# EAGLE design OSSII2CTest (EAGLE 6.1)

## Sheet 1 of 3
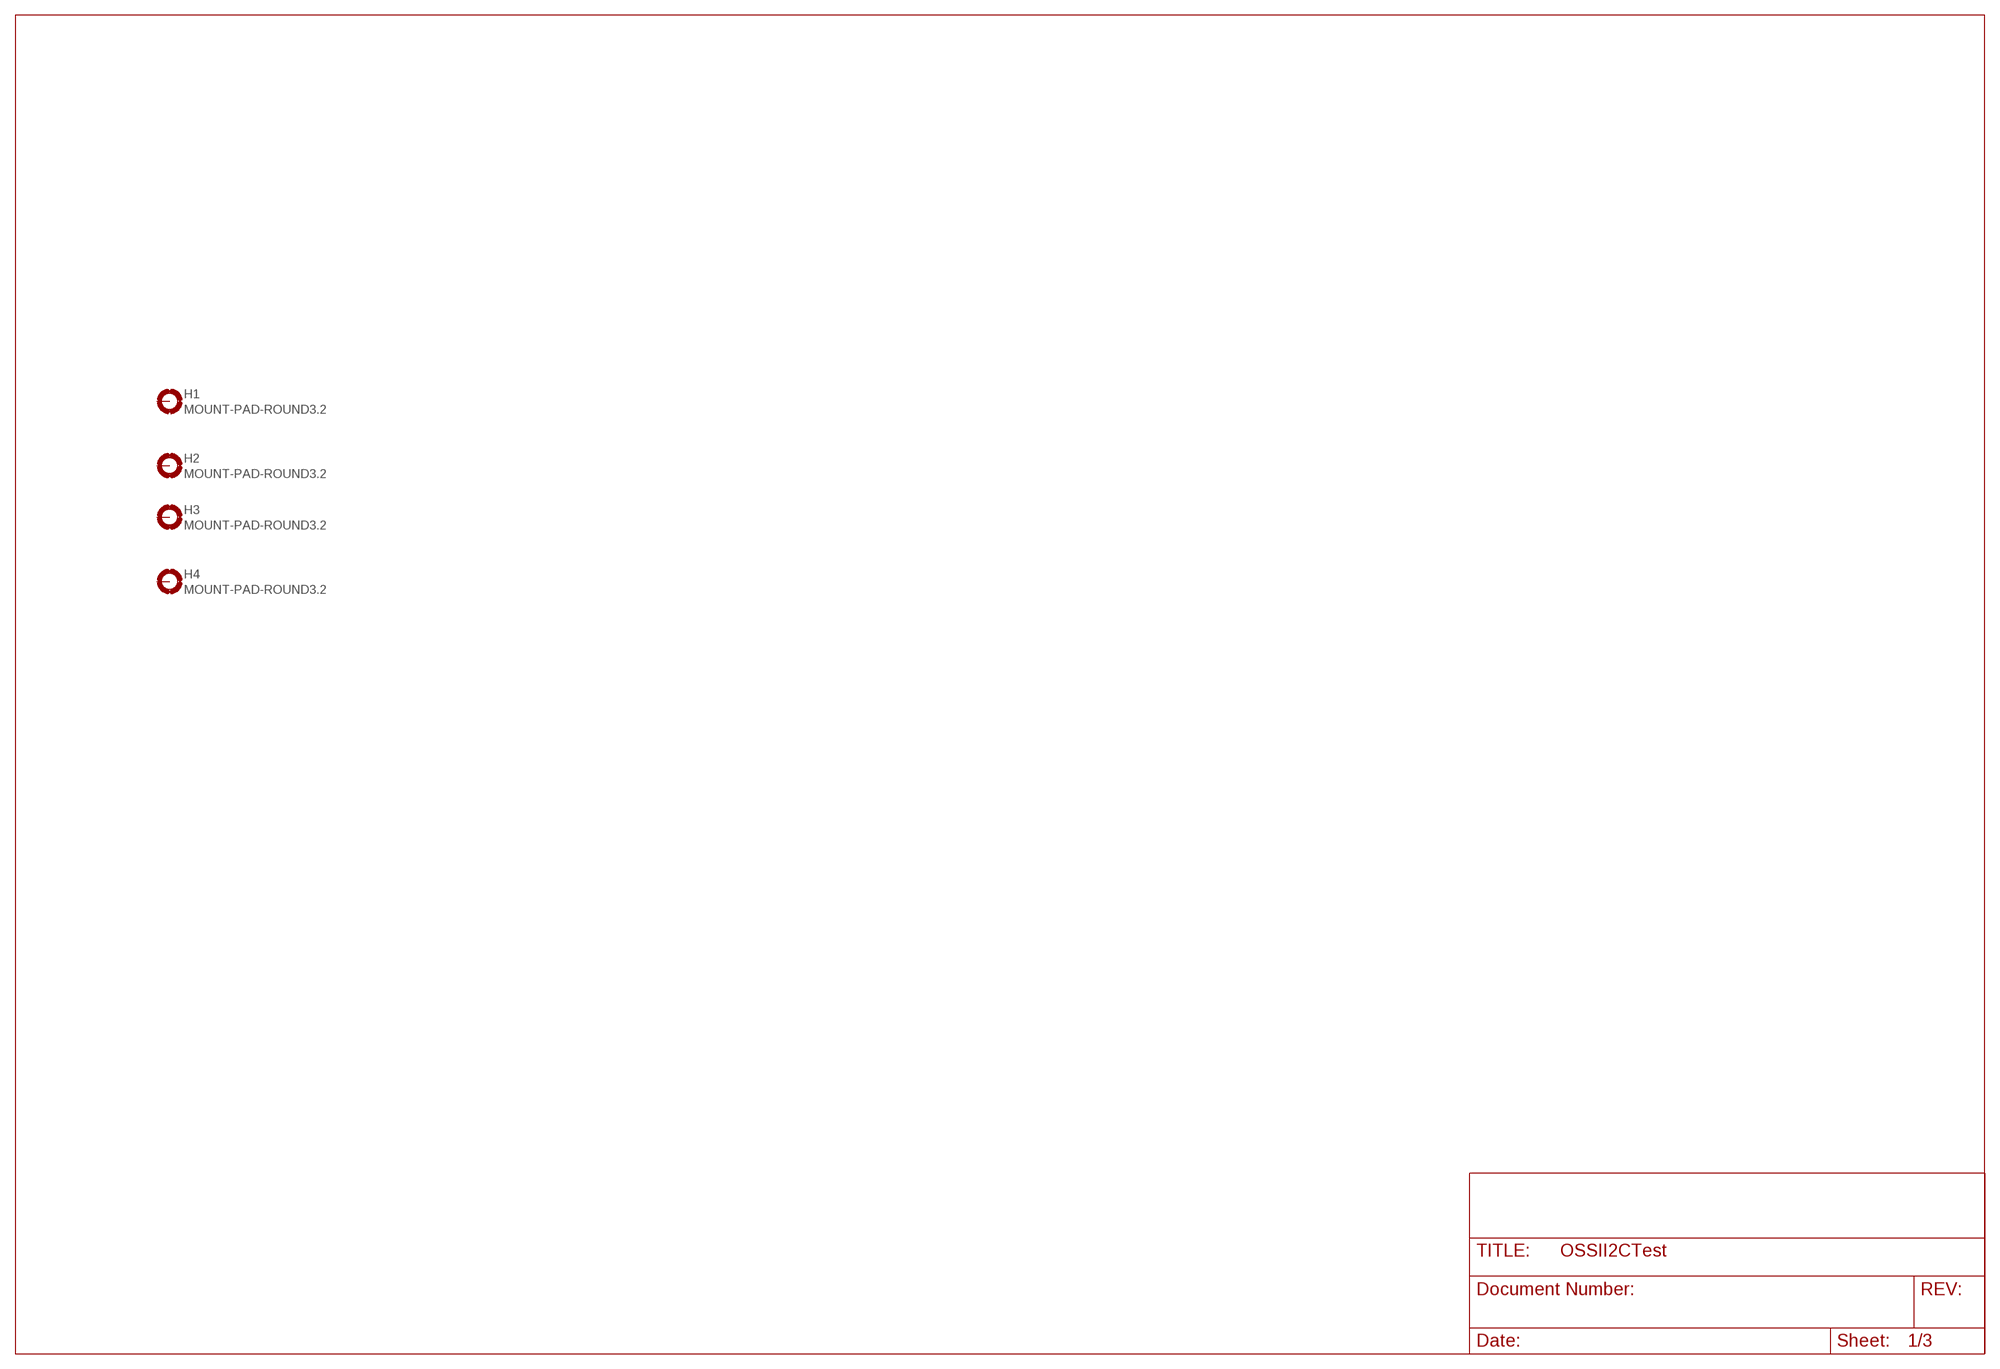
[diagram p0: schematic, sheet 1]

### Parts
H1  MOUNT-PAD-ROUND3.2  [3.2-PAD-ROUND]
H2  MOUNT-PAD-ROUND3.2  [3.2-PAD-ROUND]
H3  MOUNT-PAD-ROUND3.2  [3.2-PAD-ROUND]
H4  MOUNT-PAD-ROUND3.2  [3.2-PAD-ROUND]
Unconnected: H1.B3,2(MOUNT) H2.B3,2(MOUNT) H3.B3,2(MOUNT) H4.B3,2(MOUNT)

## Sheet 2 of 3
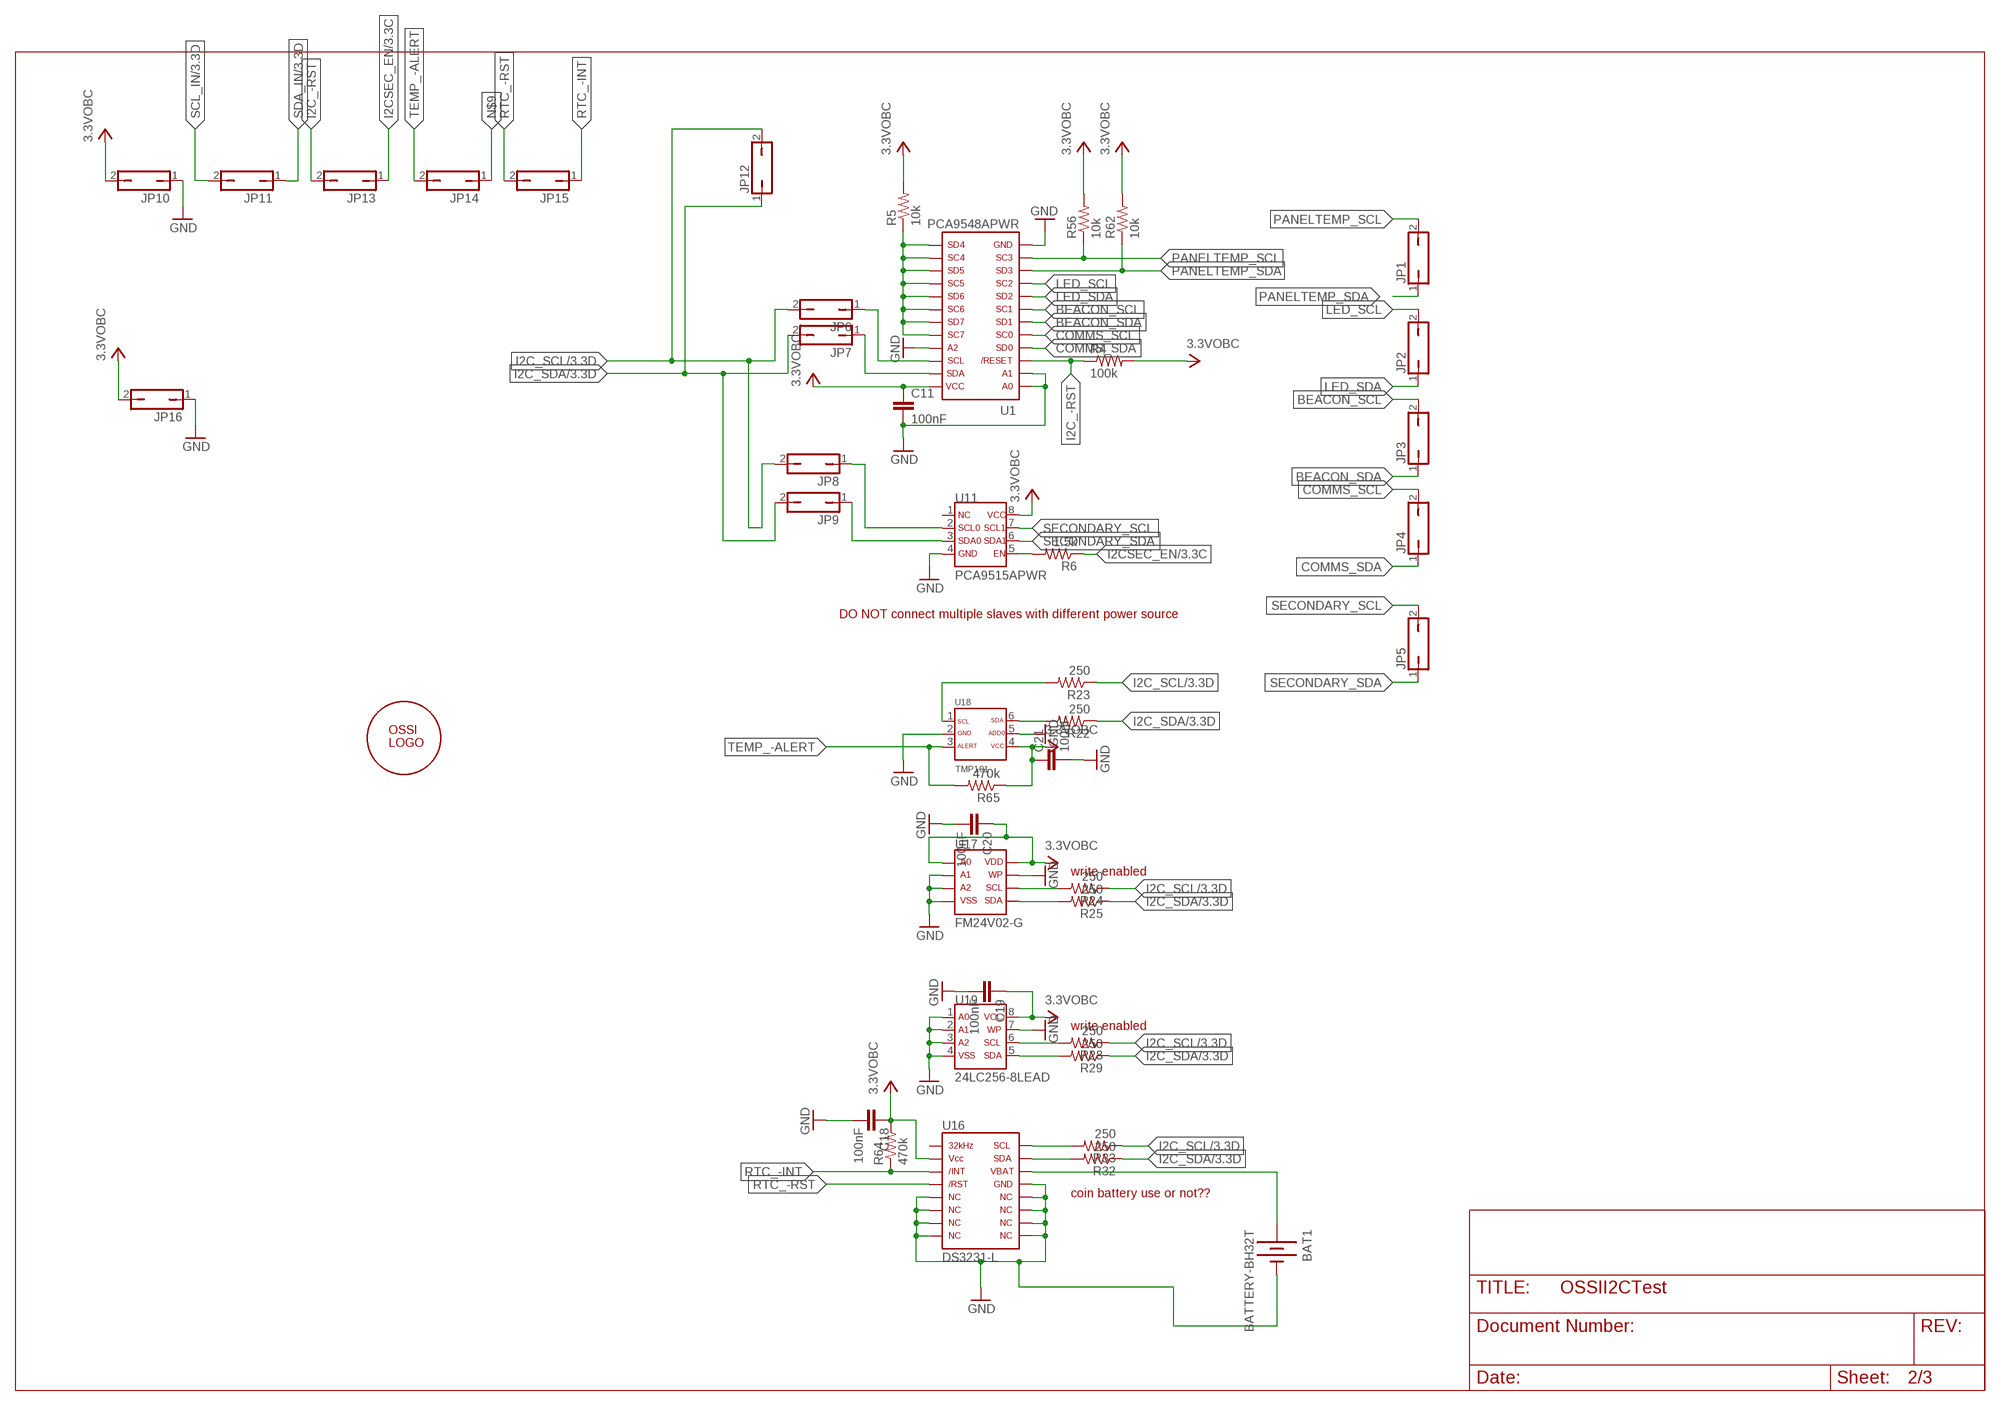
[diagram p1: schematic, sheet 2]

### Parts
BAT1  BATTERY-BH32T  [BH32T-C-G]
C11  100nF  C0603(1608)  [C0603(1608)]
C18  100nF  C0603(1608)  [C0603(1608)]
C19  100nF  C0603(1608)  [C0603(1608)]
C20  100nF  C0603(1608)  [C0603(1608)]
C21  100nF  C0603(1608)  [C0603(1608)]
JP1  JP1Q  [JP1]
JP2  JP1Q  [JP1]
JP3  JP1Q  [JP1]
JP4  JP1Q  [JP1]
JP5  JP1Q  [JP1]
JP6  JP1Q  [JP1]
JP7  JP1Q  [JP1]
JP8  JP1Q  [JP1]
JP9  JP1Q  [JP1]
JP10  JP1Q  [JP1]
JP11  JP1Q  [JP1]
JP12  JP1Q  [JP1]
JP13  JP1Q  [JP1]
JP14  JP1Q  [JP1]
JP15  JP1Q  [JP1]
JP16  JP1Q  [JP1]
R4  100k  R0603(1608)  [R0603(1608)]
R5  10k  R0603(1608)  [R0603(1608)]
R6  1.5k  R0603(1608)  [R0603(1608)]
R22  250  R0603(1608)  [R0603(1608)]
R23  250  R0603(1608)  [R0603(1608)]
R24  250  R0603(1608)  [R0603(1608)]
R25  250  R0603(1608)  [R0603(1608)]
R28  250  R0603(1608)  [R0603(1608)]
R29  250  R0603(1608)  [R0603(1608)]
R32  250  R0603(1608)  [R0603(1608)]
R33  250  R0603(1608)  [R0603(1608)]
R56  10k  R0603(1608)  [R0603(1608)]
R62  10k  R0603(1608)  [R0603(1608)]
R64  470k  R0603(1608)  [R0603(1608)]
R65  470k  R0603(1608)  [R0603(1608)]
U1  PCA9548APWR  [TSSOP-24-PW]
U11  PCA9515APWR  [TSSOP-8]
U16  DS3231-L  [SO16L]
U17  FM24V02-G  [SO8]
U18  TMP101  [SOT23-6DBV]
U19  24LC256-8LEAD  [SO08-208]
U$1  OSSITAG  [OSSISCIENCEISFANTASY]

### Nets
3.3VOBC: C11.1 C18.1 C19.1 C20.1 C21.1 JP10.2 JP16.2 R4.2 R5.2 R56.2 R62.2 R64.2 R65.1 U1.24 U11.8 U16.2 U17.1(A0) U17.8(VDD) U18.4 U19.8 ; also sheet 3
BEACON_SCL: JP3.2 U1.7
BEACON_SDA: JP3.1 U1.6
COMMS_SCL: JP4.2 U1.5
COMMS_SDA: JP4.1 U1.4
GND: BAT1.N(-) C11.2 C18.2 C19.2 C20.2 C21.2 JP10.1 JP16.1 U1.1 U1.2 U1.12 U1.21 U11.4 U16.5 U16.6 U16.7 U16.8 U16.9 U16.10 U16.11 U16.12 U16.13 U17.2(A1) U17.3(A2) U17.4(VSS) U17.7(WP) U18.2 U18.5 U19.1 U19.2 U19.3 U19.4 U19.7
I2C_-RST: JP13.2 R4.1 U1.3
I2C_SCL: JP6.2 JP8.2 JP12.2 R23.1 R24.1 R28.1 R33.1 ; also sheet 3
I2C_SDA: JP7.2 JP9.2 JP12.1 R22.1 R25.1 R29.1 R32.1 ; also sheet 3
I2CSEC_EN: JP13.1 R6.1 ; also sheet 3
LED_SCL: JP2.2 U1.9
LED_SDA: JP2.1 U1.8
N$1: JP6.1 U1.22
N$2: JP7.1 U1.23
N$3: JP8.1 U11.2
N$4: JP9.1 U11.3
N$7: R32.2 U16.15
N$9: JP14.1
N$15: R33.2 U16.16
N$16: R5.1 U1.13 U1.14 U1.15 U1.16 U1.17 U1.18 U1.19 U1.20
N$34: R29.2 U19.5
N$35: R28.2 U19.6
N$36: R25.2 U17.5(SDA)
N$39: R24.2 U17.6(SCL)
N$40: R22.2 U18.6
N$41: R23.2 U18.1
N$44: R6.2 U11.5
N$65: BAT1.P(+) U16.14
PANELTEMP_SCL: JP1.2 R56.1 U1.11
PANELTEMP_SDA: JP1.1 R62.1 U1.10
RTC_-INT: JP15.1 R64.1 U16.3
RTC_-RST: JP15.2 U16.4
SCL_IN: JP11.2 ; also sheet 3
SDA_IN: JP11.1 ; also sheet 3
SECONDARY_SCL: JP5.2 U11.7
SECONDARY_SDA: JP5.1 U11.6
TEMP_-ALERT: JP14.2 R65.2 U18.3
Unconnected: U11.1 U16.1

### Notes on the sheet
- DO NOT connect multiple slaves with different power source
- write enabled
- write enabled
- coin battery use or not??

## Sheet 3 of 3
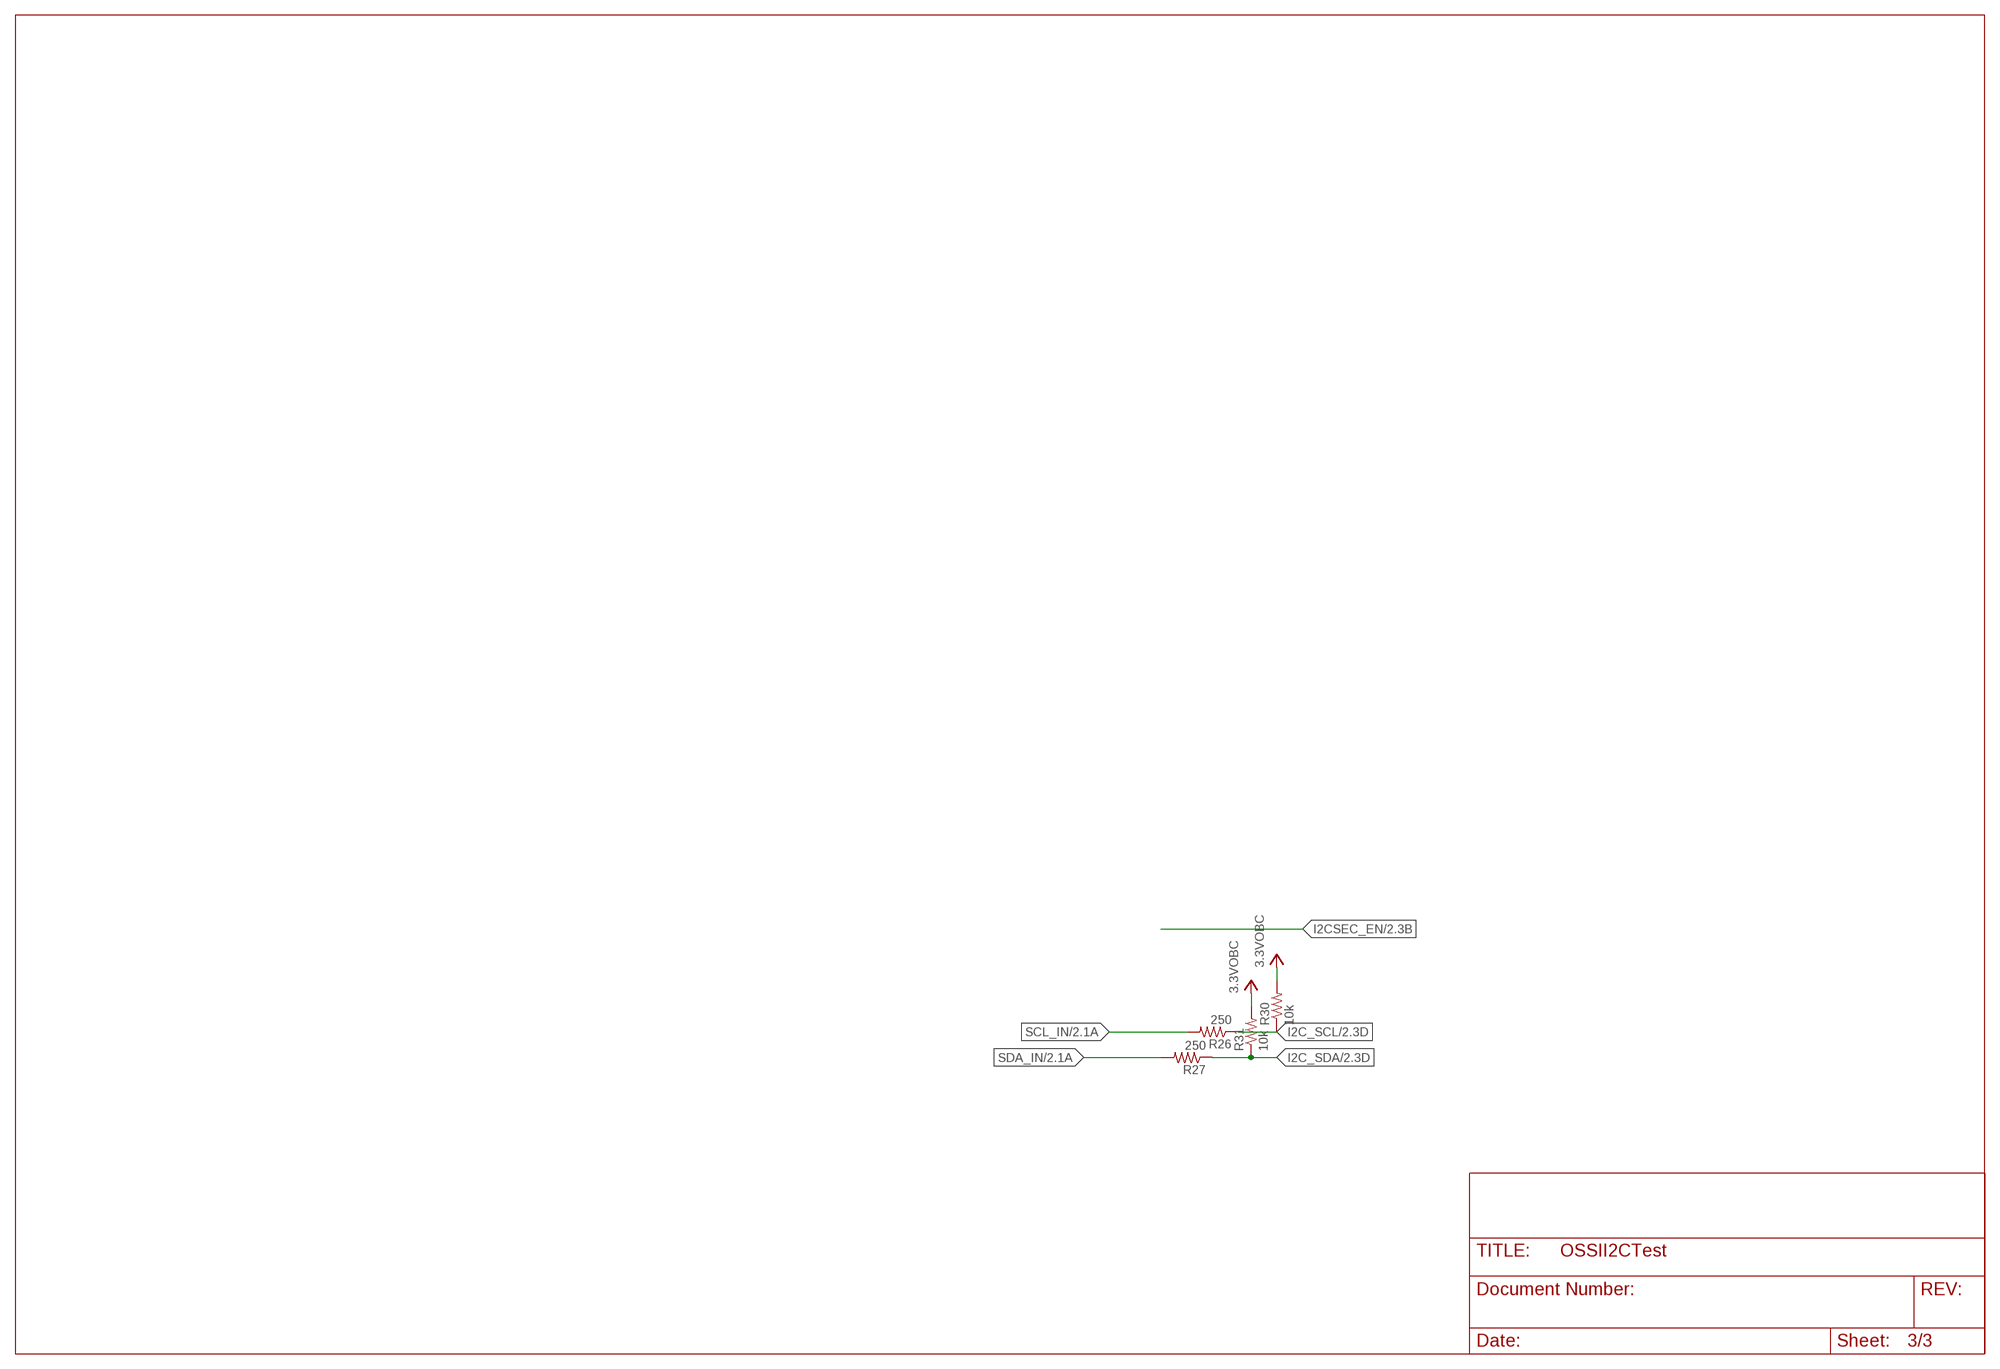
[diagram p2: schematic, sheet 3]

### Parts
R26  250  R0603(1608)  [R0603(1608)]
R27  250  R0603(1608)  [R0603(1608)]
R30  10k  R0603(1608)  [R0603(1608)]
R31  10k  R0603(1608)  [R0603(1608)]

### Nets
3.3VOBC: R30.2 R31.2 ; also sheet 2
I2C_SCL: R26.1 R30.1 ; also sheet 2
I2C_SDA: R27.1 R31.1 ; also sheet 2
SCL_IN: R26.2 ; also sheet 2
SDA_IN: R27.2 ; also sheet 2

## Library data of the parts
BAT1 = OSSI:BATTERY
C11 C18-C21 = OSSI:C
H1-H4 = OSSI:MOUNT-PAD-ROUND
JP1-JP16 = OSSI:JP1Q: JUMPER
R4-R6 R22-R33 R56 R62 R64 R65 = OSSI:R
U1 = OSSI:PCA9548APWR: PCA9548APWR 8-Channel I2C Switch With Reset 1-of-8 Bidirectional Translating Switches Address by Three Hardware Address Pins for Use of up to Eight Devices Operating Power: 2.3 V to 5.5 V Active-Low Reset Input
U11 = OSSI:PCA9515A: PCA9515A DUAL BIDIRECTIONAL I2C BUS AND SMBus REPEATER by Texas Instrument Iq = 500uA
U16 = OSSI:DS3231: DS3231 Extremely Accureate I2C integrated RTC/TCXO/Crystal by MAXIM
U17 = OSSI:FM24V02: FM24V02 256Kb Serial 3V F-RAM Memory by RAMTRON
U18 = OSSI:TMP101: TMP101 Digital Temerature Sensor with I2C Interface from Texas Instruments with Alert Function
U19 = OSSI:24LC256: 24LC256 256K I2C™ CMOS Serial EEPROM
U$1 = OSSI:OSSITAG

## Board
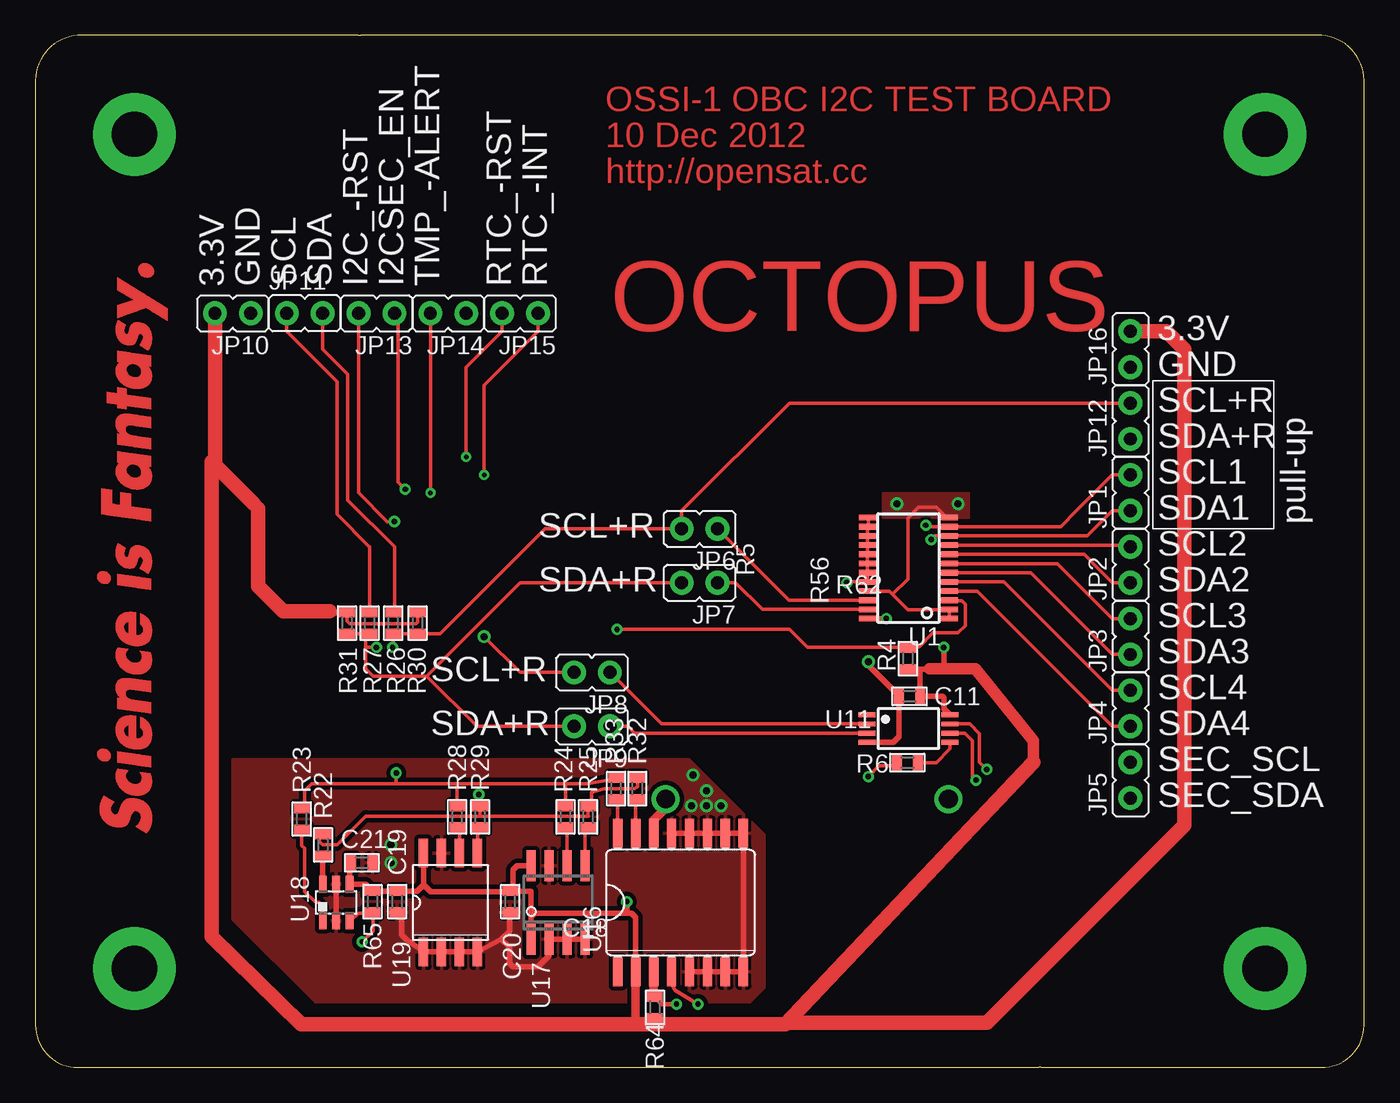
[diagram p3: board, top side]
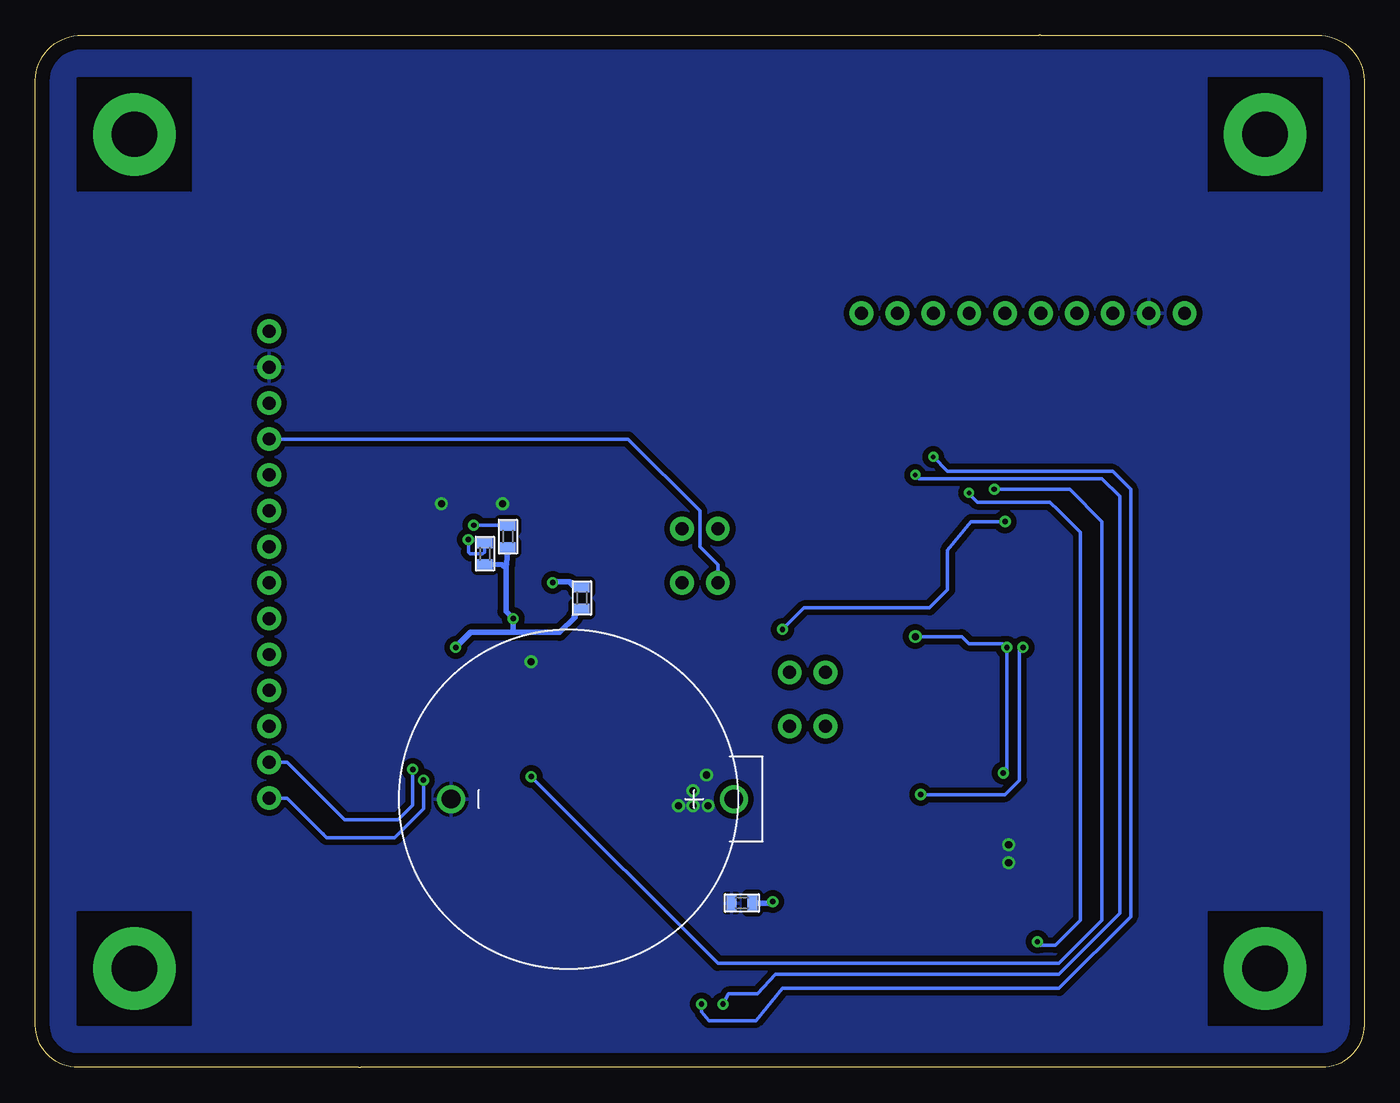
[diagram p4: board, bottom side, seen from below]

Size 94.02 x 73 mm. Coordinates in mm from the lower left corner, seen from the top.
Outline: 22.87,73 3.01,73 arc90 0.01,69.52 0.01,3 arc90 3.01,0 71.01,0 71.13,0 90.99,0 arc90 94.01,3 94.01,69.52 arc90 91.01,73 23.01,73 22.87,73
Copper layers (1*16): Top 0.035mm / dielectric 1.5mm / Bottom 0.035mm
Design rules: minimum track width 8mil, minimum drill 10mil, track to track 8mil, track to pad 8mil, pad to pad 4mil, via to via 8mil, smd to smd 2mil, copper to edge 40mil, drill to drill 8mil, minimum pad ring 8mil, minimum via ring 8mil, stop-mask expansion 4mil, vias tented up to drill 0mil, thermal gap 10mil

### Footprints (pad centres in the part's own frame; a part is rotated, then mirrored left to right if it is on the bottom)
BH32T-C-G = drill 1.32: N 0,8.3; P 0,-11.7
C0603(1608) = smd 0.7 x 1.1: 1 -0.75,0; 2 0.75,0
3.2-PAD-ROUND = drill 3.2 pad 5.842: B3,2 0,0
JP1 = drill 0.914 pad 1.676: 1 0,-1.27; 2 0,1.27
R0603(1608) = smd 0.7 x 1.1: 1 -0.75,0; 2 0.75,0
TSSOP-24-PW = smd 0.4 x 1.2: 1 -3.575,-2.9; 2 -2.925,-2.9; 3 -2.275,-2.9; 4 -1.625,-2.9; 5 -0.975,-2.9; 6 -0.325,-2.9; 7 0.325,-2.9; 8 0.975,-2.9; 9 1.625,-2.9; 10 2.275,-2.9; 11 2.925,-2.9; 12 3.575,-2.9; 13 3.575,2.9; 14 2.925,2.9; 15 2.275,2.9; 16 1.625,2.9; 17 0.975,2.9; 18 0.325,2.9; 19 -0.325,2.9; 20 -0.975,2.9; 21 -1.625,2.9; 22 -2.275,2.9; 23 -2.925,2.9; 24 -3.575,2.9
TSSOP-8 = smd 1.2 x 0.35: 1 -2.925,0.975; 2 -2.925,0.325; 3 -2.925,-0.325; 4 -2.925,-0.975; 5 2.925,-0.975; 6 2.925,-0.325; 7 2.925,0.325; 8 2.925,0.975
SO16L = smd 0.66 x 2.032: 1 -4.445,-4.902; 2 -3.175,-4.902; 3 -1.905,-4.902; 4 -0.635,-4.902; 5 0.635,-4.902; 6 1.905,-4.902; 7 3.175,-4.902; 8 4.445,-4.902; 9 4.445,4.902; 10 3.175,4.902; 11 1.905,4.902; 12 0.635,4.902; 13 -0.635,4.902; 14 -1.905,4.902; 15 -3.175,4.902; 16 -4.445,4.902
SO8 = smd 0.65 x 2.2: 1 -1.905,-2.6; 2 -0.635,-2.6; 3 0.635,-2.6; 4 1.905,-2.6; 5 1.905,2.6; 6 0.635,2.6; 7 -0.635,2.6; 8 -1.905,2.6
SOT23-6DBV = smd 0.55 x 1.2: 1 -0.95,-1.3; 2 0,-1.3; 3 0.95,-1.3; 4 0.95,1.3; 5 0,1.3; 6 -0.95,1.3
SO08-208 = smd 0.66 x 2.032: 1 -1.905,-3.498; 2 -0.635,-3.498; 3 0.635,-3.498; 4 1.905,-3.498; 5 1.905,3.498; 6 0.635,3.498; 7 -0.635,3.498; 8 -1.905,3.498

### Placement (x,y rotation side)
BAT1  56.3,18.98 90 bottom
C11  61.85,26.25 180 top
C18  44.02,11.63 180 bottom
C19  25.6,11.73 270 top
C20  33.6,11.73 270 top
C21  23.1,14.48 0 top
H1  7.01,66 0 top
H2  7.01,7 0 top
H3  87.01,7 0 top
H4  87.01,66 0 top
JP1  77.48,40.64 0 top
JP2  77.48,35.56 0 top
JP3  77.48,30.48 0 top
JP4  77.48,25.4 0 top
JP5  77.48,20.32 0 top
JP6  47,38.1 90 top
JP7  47,34.29 90 top
JP8  39.38,27.94 90 top
JP9  39.38,24.13 90 top
JP10  13.98,53.34 90 top
JP11  19.06,53.34 270 top
JP12  77.48,45.72 0 top
JP13  24.14,53.34 90 top
JP14  29.22,53.34 90 top
JP15  34.3,53.34 90 top
JP16  77.48,50.8 0 top
R4  61.74,28.92 270 top
R5  55.35,33.2 270 bottom
R6  61.7,21.57 0 top
R22  20.36,15.74 270 top
R23  18.85,17.57 270 top
R24  37.5,17.73 270 top
R25  39.12,17.73 270 top
R26  25.32,31.43 90 top
R27  23.64,31.43 90 top
R28  29.85,17.73 270 top
R29  31.47,17.73 270 top
R30  27.05,31.43 90 top
R31  22.05,31.43 90 top
R32  42.59,19.73 270 top
R33  41.09,19.73 270 top
R56  60.58,37.55 270 bottom
R62  62.2,36.34 270 bottom
R64  43.83,4.25 270 top
R65  23.85,11.73 270 top
U1  61.78,35.32 90 top
U11  61.78,23.97 0 top
U16  45.65,11.67 0 top
U17  36.99,11.67 0 top
U18  21.29,11.67 0 top
U19  29.37,11.67 0 top
U$1  10.17,15.24 90 top

### Tracks (layer width: path | path; a pad name or v marks a point on that pad's centre or on a via)
3.3VOBC  (via drill 0.38)
  Top 0.254: R31.2 22.05,31.55 22.23,31.37 26.93,31.37 27.06,31.5 27.06,32.16 R30.2
  Top 0.406: R31.2 20.92,32.18 20.84,32.26 | R64.2 44.71,3.31 44.97,3.05 | U16.2 42.47,10.63 42.18,10.92 41.91,10.92 | 41.91,10.92 35.31,10.92 35.06,10.67 | 35.06,10.67 35.06,9.09 U17.1 | U17.8 34.09,14.27 33.79,13.97 33.79,12.67 C20.1 | C20.1 35.03,12.48 35.06,12.45 35.06,10.67 | U19.8 27.46,12.93 | 27.46,12.93 27.95,12.45 33.56,12.45 C20.1 | 27.46,12.93 27.01,12.48 C19.1 R65.1 | R65.1 | C21.1 22.24,14.36 U18.4 23.36,12.97 R65.1 | R4.2 62.75,28.17 | 62.75,28.17 63.23,28.17 63.25,28.19 | 62.75,28.17 62.6,28.03 C11.1 64.18,26.25 64.27,26.16 64.27,25.38 U11.8 | v64.27,29.72 64.27,28.19 | U1.24 v60.2,31.75 v60.21,31.75 | v41.85,11.73 41.85,10.98 41.91,10.92
  Top 0.61: R64.2 43.87,3.25 43.85,3.23 42.6,3.23 42.47,3.35 U16.2
  Top 0.813: 70.6,21.59 70.6,23.11 66.52,28.19 64.27,28.19 63.25,28.19
  Top 1.016: 53.58,3.59 53.06,3.05 44.97,3.05 18.8,3.05 12.47,9.23 12.47,25.3 12.47,41.91 | 53.58,3.59 70.6,21.59 | 20.84,32.26 17.53,32.26 15.76,34.04 15.76,39.5 15.45,39.88 12.47,42.85 12.47,41.91 | JP10.2 12.71,42.15 12.47,41.91 | JP16.2 80.02,52.07 81.29,50.8 81.29,17.14 67.32,3.17 53.35,3.17 53.35,3.36 53.58,3.59
  Bottom 0.406: 60.21,30.77 56.93,30.77 55.85,31.86 55.89,31.9 R5.2 | 60.21,30.77 63.21,30.77 v64.27,29.72 | 60.21,30.77 60.21,31.03 v60.21,31.75 60.71,32.26 60.71,35.31 | R56.2 60.71,35.31 | R62.2 60.98,35.57 60.71,35.31 | C18.1 41.95,11.63 v41.85,11.73
BEACON_SCL
  Top 0.254: U1.7 72.31,35.65 72.4,35.56 76.21,31.75 JP3.2
BEACON_SDA
  Top 0.254: JP3.1 76.21,29.21 71.13,34.29 70.42,34.99 U1.6
COMMS_SCL
  Top 0.254: JP4.2 76.21,26.67 68.59,34.29 68.53,34.34 U1.5
COMMS_SDA
  Top 0.254: JP4.1 76.21,24.13 67.32,33.02 66.64,33.7 U1.4
GND  (via drill 0.5)
  Top 0.254: U1.21 60.42,33.7 60.65,33.47 | 60.65,33.47 61.73,32.38 64.67,32.38 U1.2 U1.1 | U1.12 64.49,38.9 63.76,39.62 62.49,39.62 61.73,38.86 61.73,34.54 60.65,33.47
  Top 0.406: U18.2 U18.5 | U17.4 U17.3 U17.2 36.35,7.9 35.57,7.11 33.79,7.11 33.54,7.37 33.54,8.49 32.95,9.07 | U11.4 60.71,22.99 61.1,23.38 C11.2 61.1,26.28 58.94,28.45 v58.94,28.7 | U16.13 U16.12 U16.11 U16.10 U16.9 U16.8 U16.7 U16.6 U16.5 | 32.95,9.07 U19.4 U19.3 U19.2 U19.1 26.24,9.07 25.92,9.4 25.92,10.92 C19.2 | 32.95,9.07 33.54,9.65 33.54,10.92 C20.2
  other vias: 60.97,39.88 65.29,39.88 47.49,19.57 48.51,18.52 46.52,20.68 46.41,18.52 25.15,14.48 25.15,15.75 47.49,18.52
  pour Bottom (isolate 0.406): 94.01,73.05 0.01,73.05 0.01,0 93.99,0
  pour Top (no thermals): 66.05,38.86 59.95,38.86 59.95,40.64 66.05,40.64
  pour Top (isolate 0.305): 13.98,21.84 46.24,21.84 51.57,16.51 51.57,5.59 50.55,4.57 19.82,4.57 13.98,10.41
I2C_-RST  (via drill 0.38, 0.4)
  Top 0.254: 61.48,29.72 61.73,29.76 | 61.73,29.76 R4.1 61.69,29.72 54.62,29.72 53.35,30.99 v41.16,30.99 | 61.73,29.76 62.53,29.76 63.51,30.73 65.29,30.73 65.79,31.24 65.79,32.77 65.54,33.02 64.78,33.02 64.75,33.05 U1.3 | v25.41,38.61 24.9,38.61 22.87,40.64 JP13.2
  Bottom 0.254: v25.41,38.61 27.82,38.61 29.47,36.58 29.47,33.78 30.74,32.51 39.63,32.51 v41.16,30.99
I2C_SCL  (via drill 0.38, 0.5)
  Top 0.254: R33.1 41.47,20.5 39.03,20.07 37.35,20.07 | 37.35,20.07 29.73,20.07 | 29.73,20.07 25.54,20.07 | 25.54,20.07 19.57,20.07 19.06,19.56 19.06,18.54 18.84,18.32 | R23.1 18.84,18.32 | 18.84,18.32 18.8,18.29 | v25.28,29.72 25.32,29.68 R26.1 R30.1 28.65,30.68 31.12,33.15 36.08,38.1 JP6.2 45.73,39.37 53.35,46.99 JP12.2 | v25.54,20.83 25.54,20.07 | R28.1 29.85,19.94 29.73,20.07 | R24.1 37.5,19.91 37.35,20.07 | JP8.2 34.3,27.94 v31.76,30.48
  Bottom 0.254: v25.54,20.83 25.28,21.08 v25.28,29.72 25.54,29.98 27.97,29.98 28.47,30.48 v31.76,30.48
I2C_SDA  (via drill 0.38)
  Top 0.254: 31.47,17.78 39.12,17.78 39.12,17.79 R25.1 39,18.54 39,18.48 | R22.1 20.07,16.2 20.07,16 20.33,15.75 21.34,15.75 23.38,17.78 31.47,17.78 | 27.69,27.69 23.88,27.69 23.38,28.19 23.38,29.72 | 23.38,29.72 23.38,30.66 | 23.38,30.66 R27.1 | 23.38,30.66 22.32,30.66 R31.1 | v31.38,19.3 31.47,19.21 R29.1 31.47,17.78 | v24.14,29.72 23.38,29.72 | R32.1 42.59,19.84 42.35,19.73 40.22,19.73 39.35,19.48 39.35,18.98 38.85,18.48 39,18.48 | 39,18.48 39.1,18.48 | 27.69,27.69 28.96,28.96 34.3,34.29 JP7.2 | JP9.2 31.25,24.13 27.69,27.69
  Bottom 0.254: v31.38,19.3 25.41,19.3 24.39,20.32 24.39,29.46 v24.14,29.72 | JP7.2 45.73,35.56 47,36.83 47,39.37 52.08,44.45 JP12.1
I2CSEC_EN  (via drill 0.38)
  Top 0.254: v26.17,40.89 25.66,41.4 25.66,51.31 25.66,53.09 JP13.1 | v58.94,20.57 59.7,21.34 60.71,21.34 R6.1 | R6.1 | R6.1 60.97,21.59
  Bottom 0.254: v26.17,40.89 20.84,40.89 18.55,38.61 18.55,10.41 21.6,7.37 45.73,7.37 v58.94,20.57
LED_SCL
  Top 0.254: U1.9 77.36,36.95 JP2.2
LED_SDA
  Top 0.254: U1.8 74.2,36.3 74.94,35.56 76.21,34.29 JP2.1
N$1
  Top 0.254: U1.22 53.32,33.05 JP6.1
N$2
  Top 0.254: U1.23 51.43,32.4 49.54,34.29 JP7.1
N$3
  Top 0.254: U11.2 44.29,24.3 JP8.1
N$4
  Top 0.254: U11.3 42.4,23.64 41.92,24.13 JP9.1
N$7
  Top 0.254: U16.15 42.47,18.99 R32.2
N$15
  Top 0.254: U16.16 41.2,18.87 R33.2
N$16  (via drill 0.38)
  Top 0.254: U1.13 58.94,38.9 58.94,38.35 58.88,38.35 U1.14 U1.15 U1.16 U1.17 U1.18 U1.19 U1.20 57.41,34.34 v57.41,34.29
  Bottom 0.406: R5.1 55.89,34.02 56.22,34.35 57.35,34.35 v57.41,34.29 | v57.41,34.29 | v57.41,34.29 57.47,34.23
N$34
  Top 0.254: U19.5 31.27,16.79 R29.2
N$35
  Top 0.254: U19.6 30,17 29.98,17.02 29.94,16.98 R28.2
N$36
  Top 0.254: U17.5 38.89,16.75 R25.2
N$39
  Top 0.254: U17.6 37.62,16.86 R24.2
N$40
  Top 0.406: U18.6 20.34,14.97 R22.2
N$41
  Top 0.254: R23.2 18.85,15.7 19.06,15.49 19.06,12.45 19.82,11.68 20.07,11.68 20.33,11.43 20.33,10.41 20.34,10.4 U18.1
N$44
  Top 0.254: R6.2 63.74,21.57 64.7,22.53 U11.5
N$63
  cutout Bottom (isolate 0.305, no thermals): 3.01,11 3.01,3 11.01,3 11.01,11
  cutout Bottom (isolate 0.305, no thermals): 83.01,11 83.01,3 91.01,3 91.01,11
  cutout Bottom (isolate 0.305, no thermals): 3.01,70 3.01,62 11.01,62 11.01,70
  cutout Bottom (isolate 0.305, no thermals): 83.01,70 83.01,62 91.01,62 91.01,70
N$65
  Top 0.61: U16.14 43.74,17.5 44.47,18.23 44.47,18.8 BAT1.P
PANELTEMP_SCL  (via drill 0.38)
  Top 0.254: U1.11 68.23,38.24 | U1.11 63.11,38.24 v63,38.35 | U1.11 68.23,38.24 | JP1.2 76.21,41.91 73.67,39.37 72.54,38.24 68.23,38.24
  Bottom 0.254: v63,38.35 60.73,38.35 R56.1
PANELTEMP_SDA  (via drill 0.38)
  Top 0.254: v63.38,37.34 63.64,37.59 U1.10 74.43,37.59 74.94,38.1 76.21,39.37 JP1.1
  Bottom 0.254: v63.38,37.34 63.38,36.45 63.25,36.32 62.37,36.32 62.24,36.45 R62.1 62.24,37.08
RTC_-INT  (via drill 0.3, 0.38)
  Top 0.254: v45.36,4.48 45.22,4.49 | v31.76,41.91 31.76,48.26 35.57,52.07 JP15.1
  Top 0.305: 45.22,4.49 44.31,4.49 R64.1
  Top 0.61: U16.3 43.74,5.22 R64.1
  Bottom 0.254: v45.36,4.48 44.99,5.21 42.93,5.21 41.66,6.6 21.6,6.6 17.28,10.92 17.28,40.39 18.55,41.66 31.5,41.66 v31.76,41.91
RTC_-RST  (via drill 0.3, 0.38)
  Top 0.254: U16.4 45.01,5.94 44.97,5.98 45.26,5.48 v46.88,4.48 | v30.49,43.18 30.49,49.53 33.03,52.07 JP15.2
  Bottom 0.254: v46.88,4.48 46.88,3.96 46.37,3.32 43.05,3.32 41.16,5.59 21.6,5.59 16.52,10.67 16.52,40.89 17.79,42.16 29.47,42.16 v30.49,43.18
SCL_IN
  Top 0.254: 25.41,32.02 R26.2 25.41,32.27 25.41,36.83 22.11,40.13 22.11,49.02 20.33,50.8 20.33,52.07 JP11.2
SDA_IN
  Top 0.254: 18.8,51.05 19.06,50.8 | 19.06,50.8 21.34,48.51 21.34,39.12 23.63,36.83 23.64,36.82 R27.2 23.63,31.94 | JP11.1 17.79,52.07 18.8,51.05 | 18.8,51.05 19.06,50.8 | 18.8,51.05 19.06,50.8
SECONDARY_SCL  (via drill 0.38)
  Top 0.254: U11.7 66.14,24.3 66.81,23.62 66.81,21.59 v67.32,21.08
  Bottom 0.254: v67.32,21.08 67.32,18.54 68.33,17.53 72.04,17.53 72.14,17.53 76.21,21.59 JP5.2
SECONDARY_SDA  (via drill 0.38)
  Top 0.254: U11.6 65.77,23.64 66.3,23.11 66.3,20.57 v66.56,20.32
  Bottom 0.254: v66.56,20.32 66.56,18.29 68.59,16.26 73.41,16.26 73.67,16.51 73.66,16.52 73.68,16.52 76.21,19.05 JP5.1
TEMP_-ALERT  (via drill 0.3, 0.38)
  Top 0.254: v23.12,8.89 23.88,9.65 23.88,10.94 R65.2 23.79,10.92 22.87,10.92 22.32,10.37 U18.3 | JP14.2 v27.95,40.64
  Bottom 0.254: v23.12,8.89 22.87,8.64 21.85,8.64 20.07,10.41 20.07,37.59 20.07,37.85 21.6,39.37 22.22,39.99 27.37,39.99 27.95,40.57 v27.95,40.64

### Text on the board
Top: OSSI-1 OBC I2C TEST BOARD | 10 Dec 2012 | http://opensat.cc | OCTOPUS
tPlace: 3.3V | GND | SCL | SDA | I2C_-RST | I2CSEC_EN | TMP_-ALERT | RTC_-RST | RTC_-INT | 3.3V | GND | SCL+R | SDA+R | SCL1 | SDA1 | pull-up | SCL+R | SCL2 | SDA+R | SDA2 | SCL3 | SDA3 | SCL+R | SCL4 | SDA+R | SDA4 | SEC_SCL | SEC_SDA
tStop: OSSI-1 OBC I2C TEST BOARD | 10 Dec 2012 | http://opensat.cc | OCTOPUS